# Altium schematic sheet Project_Overview.SchDoc
size A4; SheetNumber: 1; SheetTotal: 13; BoardName: ECG Reader Board
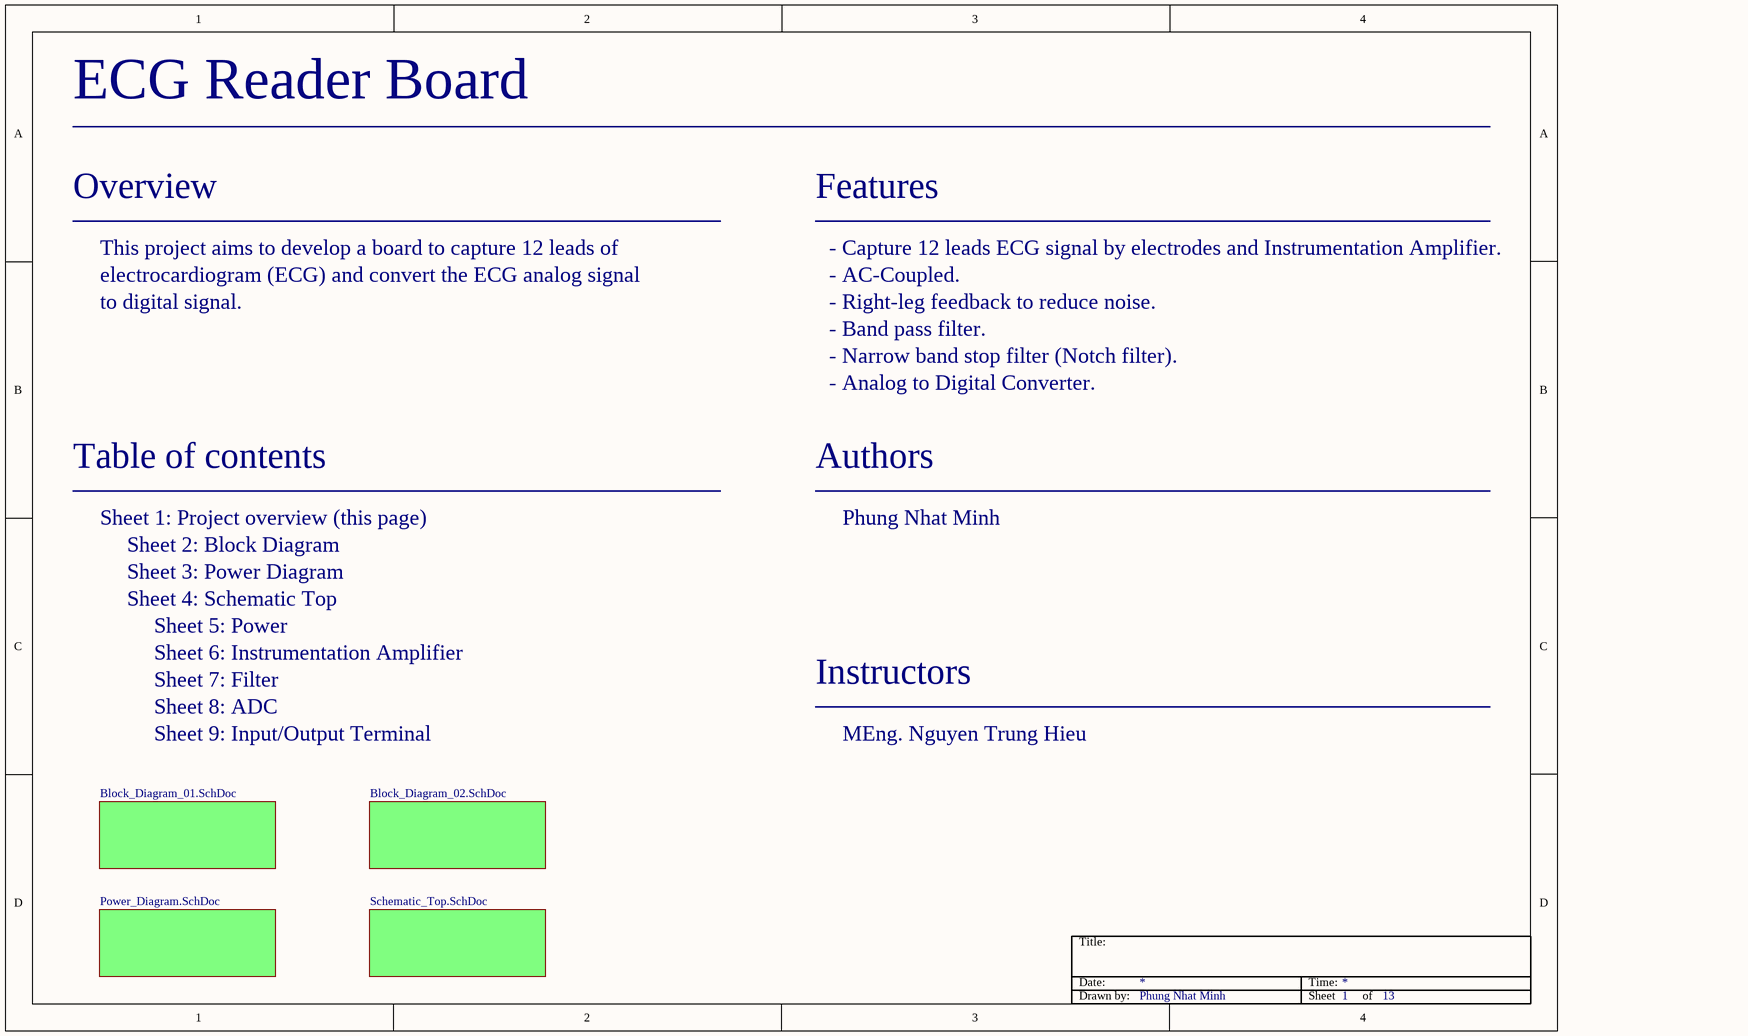
[diagram p0: Project_Overview.SchDoc]

## Sub-sheets
Designator = Block_Diagram_01.SchDoc: no entries
Designator = Power_Diagram.SchDoc: no entries
Designator = Schematic_Top.SchDoc: no entries
Designator = Block_Diagram_02.SchDoc: no entries

## Notes on the sheet
- Overview
- Features
- This project aims to develop a board to capture 12 leads of
- electrocardiogram (ECG) and convert the ECG analog signal
- to digital signal.
- - Right-leg feedback to reduce noise.
- - AC-Coupled.
- - Capture 12 leads ECG signal by electrodes and Instrumentation Amplifier.
- - Narrow band stop filter (Notch filter).
- - Band pass filter.
- - Analog to Digital Converter.
- Table of contents
- Authors
- Sheet 1: Project overview (this page)
- Sheet 2: Block Diagram
- Sheet 3: Power Diagram
- Phung Nhat Minh
- Sheet 4: Schematic Top
- Sheet 5: Power
- Sheet 7: Filter
- Sheet 6: Instrumentation Amplifier
- Sheet 8: ADC
- Instructors
- Sheet 9: Input/Output Terminal
- MEng. Nguyen Trung Hieu
- Title:
- Date:
- Time:
- Drawn by:
- Sheet
- of